# EAGLE design SpaStroWi_V1_R0 (EAGLE 7.7.0)
ABTEILUNG: Technische Informatik; BEARBEITER: Leon Hipf; DATUM: 20.3.2021; DOKUMENTART: Schaltplan; GEZ: HipL; ID: 5; REV: 0; SCHALTPLAN: SpaStroWi; STATUS: Prototyp; VER: 1.0

## Sheet 1 of 2
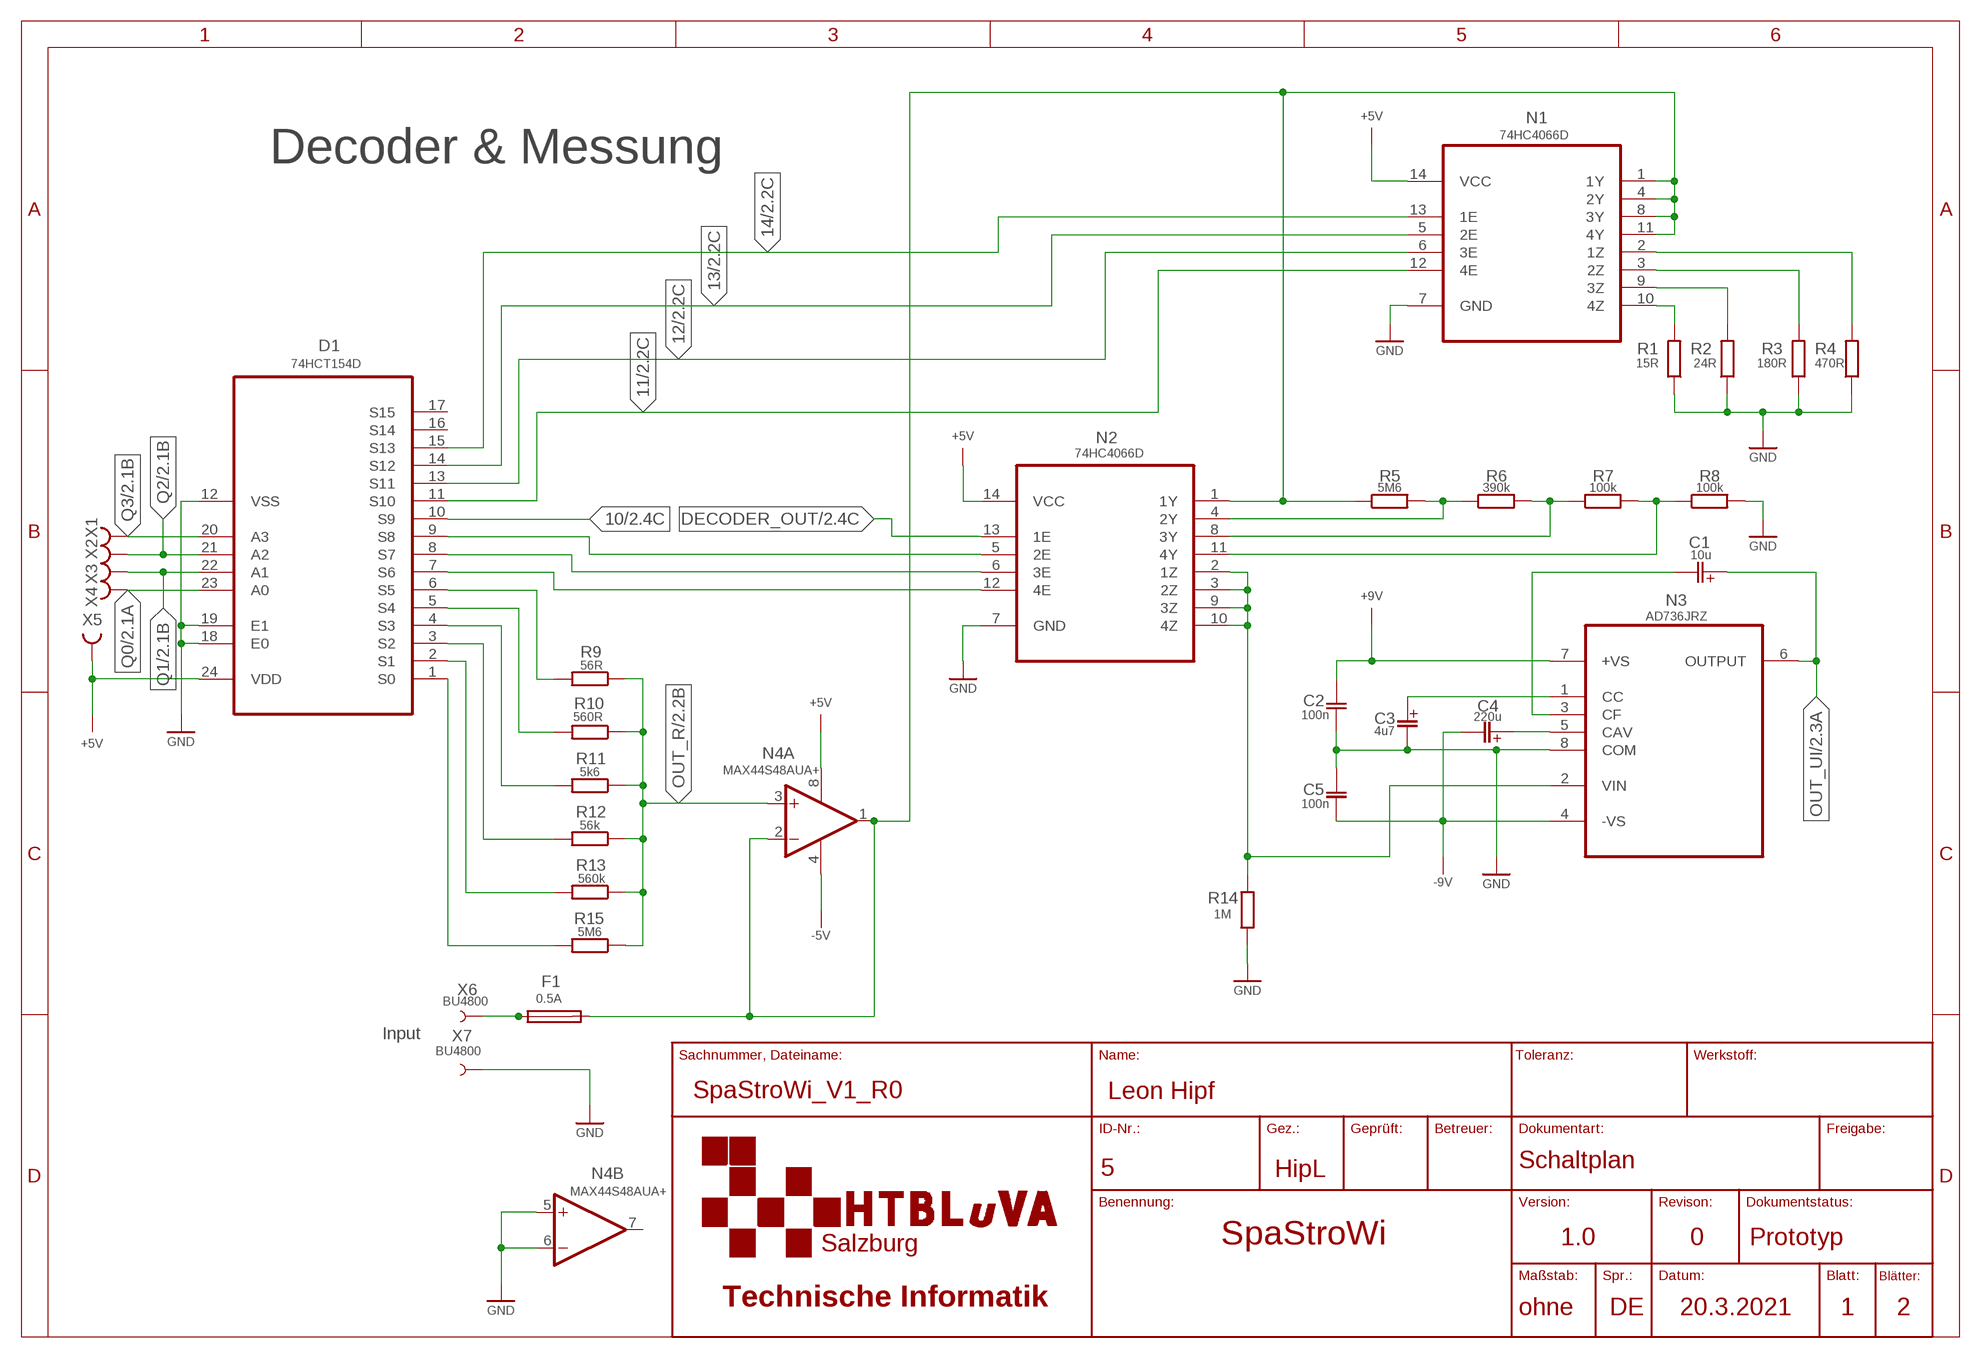
[diagram p0: schematic, sheet 1]

### Parts
C1  10u  CPOL-EU153CLV-0405  [153CLV-0405]
C2  100n  C-EUC0805  [C0805]
C3  4u7  CPOL-EU153CLV-0405  [153CLV-0405]
C4  220u  CPOL-EU153CLV-0405  [153CLV-0405]
C5  100n  C-EUC0805  [C0805]
D1  74HCT154D  [SOIC127P1030X265-24N]
F1  0.5A  [354-0101ZXGY]
N1  74HC4066D  74HC4066D,653  [SOIC127P600X175-14N]
N2  74HC4066D  74HC4066D,653  [SOIC127P600X175-14N]
N3  AD736JRZ  AD736JRZ_THT  [DIP794W45P254L959H508Q8]
N4  MAX44S48AUA+  [SOP65P490X110-8N]
R1  15R  R-EU_R2010  [R2010]
R2  24R  R-EU_R2512  [R2512]
R3  180R  R-EU_R0402  [R0402]
R4  470R  R-EU_R0805  [R0805]
R5  5M6  R-EU_R0805  [R0805]
R6  390k  R-EU_R0805  [R0805]
R7  100k  R-EU_R0805  [R0805]
R8  100k  R-EU_R0805  [R0805]
R9  56R  R-EU_R0805  [R0805]
R10  560R  R-EU_R0805  [R0805]
R11  5k6  R-EU_R0805  [R0805]
R12  56k  R-EU_R0805  [R0805]
R13  560k  R-EU_R0805  [R0805]
R14  1M  R-EU_R0805  [R0805]
R15  5M6  R-EU_R0805  [R0805]
X1  BUCHSE-V_0.8MM  [LSP08]
X2  BUCHSE-V_0.8MM  [LSP08]
X3  BUCHSE-V_0.8MM  [LSP08]
X4  BUCHSE-V_0.8MM  [LSP08]
X5  BUCHSE-V_0.8MM  [LSP08]
X6  BU4800  [BU4800]
X7  BU4800  [BU4800]

### Nets
10: D1.10(S9) ; also sheet 2
11: D1.11(S10) N1.12(4E) ; also sheet 2
12: D1.13(S11) N1.6(3E) ; also sheet 2
13: D1.14(S12) N1.5(2E) ; also sheet 2
14: D1.15(S13) N1.13(1E) ; also sheet 2
+5V: D1.24(VDD) N1.14(VCC) N2.14(VCC) N4.8(A:VCC+) X5.MP ; also sheet 2
+9V: C2.1 N3.7(+VS) ; also sheet 2
-5V: N4.4(A:VCC-) ; also sheet 2
-9V: C4.- C5.2 N3.4(-VS) ; also sheet 2
DECODER_OUT: N2.13(1E) ; also sheet 2
GND: C2.2 C3.- C5.1 D1.12(VSS) D1.18(E0) D1.19(E1) N1.7(GND) N2.7(GND) N3.8(COM) N4.5(B:NON-INVERTING_INPUT2) N4.6(B:INVERTING_INPUT2) R1.1 R2.1 R3.1 R4.1 R8.2 R14.1 X7.P$1(KL) ; also sheet 2
INPUT: F1.2 N1.1(1Y) N1.4(2Y) N1.8(3Y) N1.11(4Y) N2.1(1Y) N4.1(A:OUTPUT1) N4.2(A:INVERTING_INPUT1) R5.1
N$1: D1.1(S0) R15.2
N$2: D1.2(S1) R13.2
N$3: D1.3(S2) R12.2
N$4: D1.4(S3) R11.2
N$5: D1.5(S4) R10.2
N$7: D1.7(S6) N2.12(4E)
N$10: F1.1 X6.P$1(KL)
N$12: N1.10(4Z) R1.2
N$13: N1.9(3Z) R2.2
N$15: C3.+ N3.1(CC)
N$20: N2.8(3Y) R6.2 R7.1
N$21: N1.3(2Z) R3.2
N$22: N1.2(1Z) R4.2
N$23: N2.11(4Y) R7.2 R8.1
N$24: N2.4(2Y) R5.2 R6.1
N$28: N2.2(1Z) N2.3(2Z) N2.9(3Z) N2.10(4Z) N3.2(VIN) R14.2
N$31: C4.+ N3.5(CAV)
N$32: C1.- N3.3(CF)
N$33: D1.6(S5) R9.2
N$37: D1.8(S7) N2.6(3E)
N$39: D1.9(S8) N2.5(2E)
OUT_R: N4.3(A:NON-INVERTING_INPUT1) R9.1 R10.1 R11.1 R12.1 R13.1 R15.1 ; also sheet 2
OUT_UI: C1.+ N3.6(OUTPUT) ; also sheet 2
Q0: D1.23(A0) X4.MP ; also sheet 2
Q1: D1.22(A1) X3.MP ; also sheet 2
Q2: D1.21(A2) X2.MP ; also sheet 2
Q3: D1.20(A3) X1.MP ; also sheet 2
Unconnected: D1.16(S14) D1.17(S15) N4.7(B:OUTPUT2)

### Notes on the sheet
- Decoder & Messung
- Input

## Sheet 2 of 2
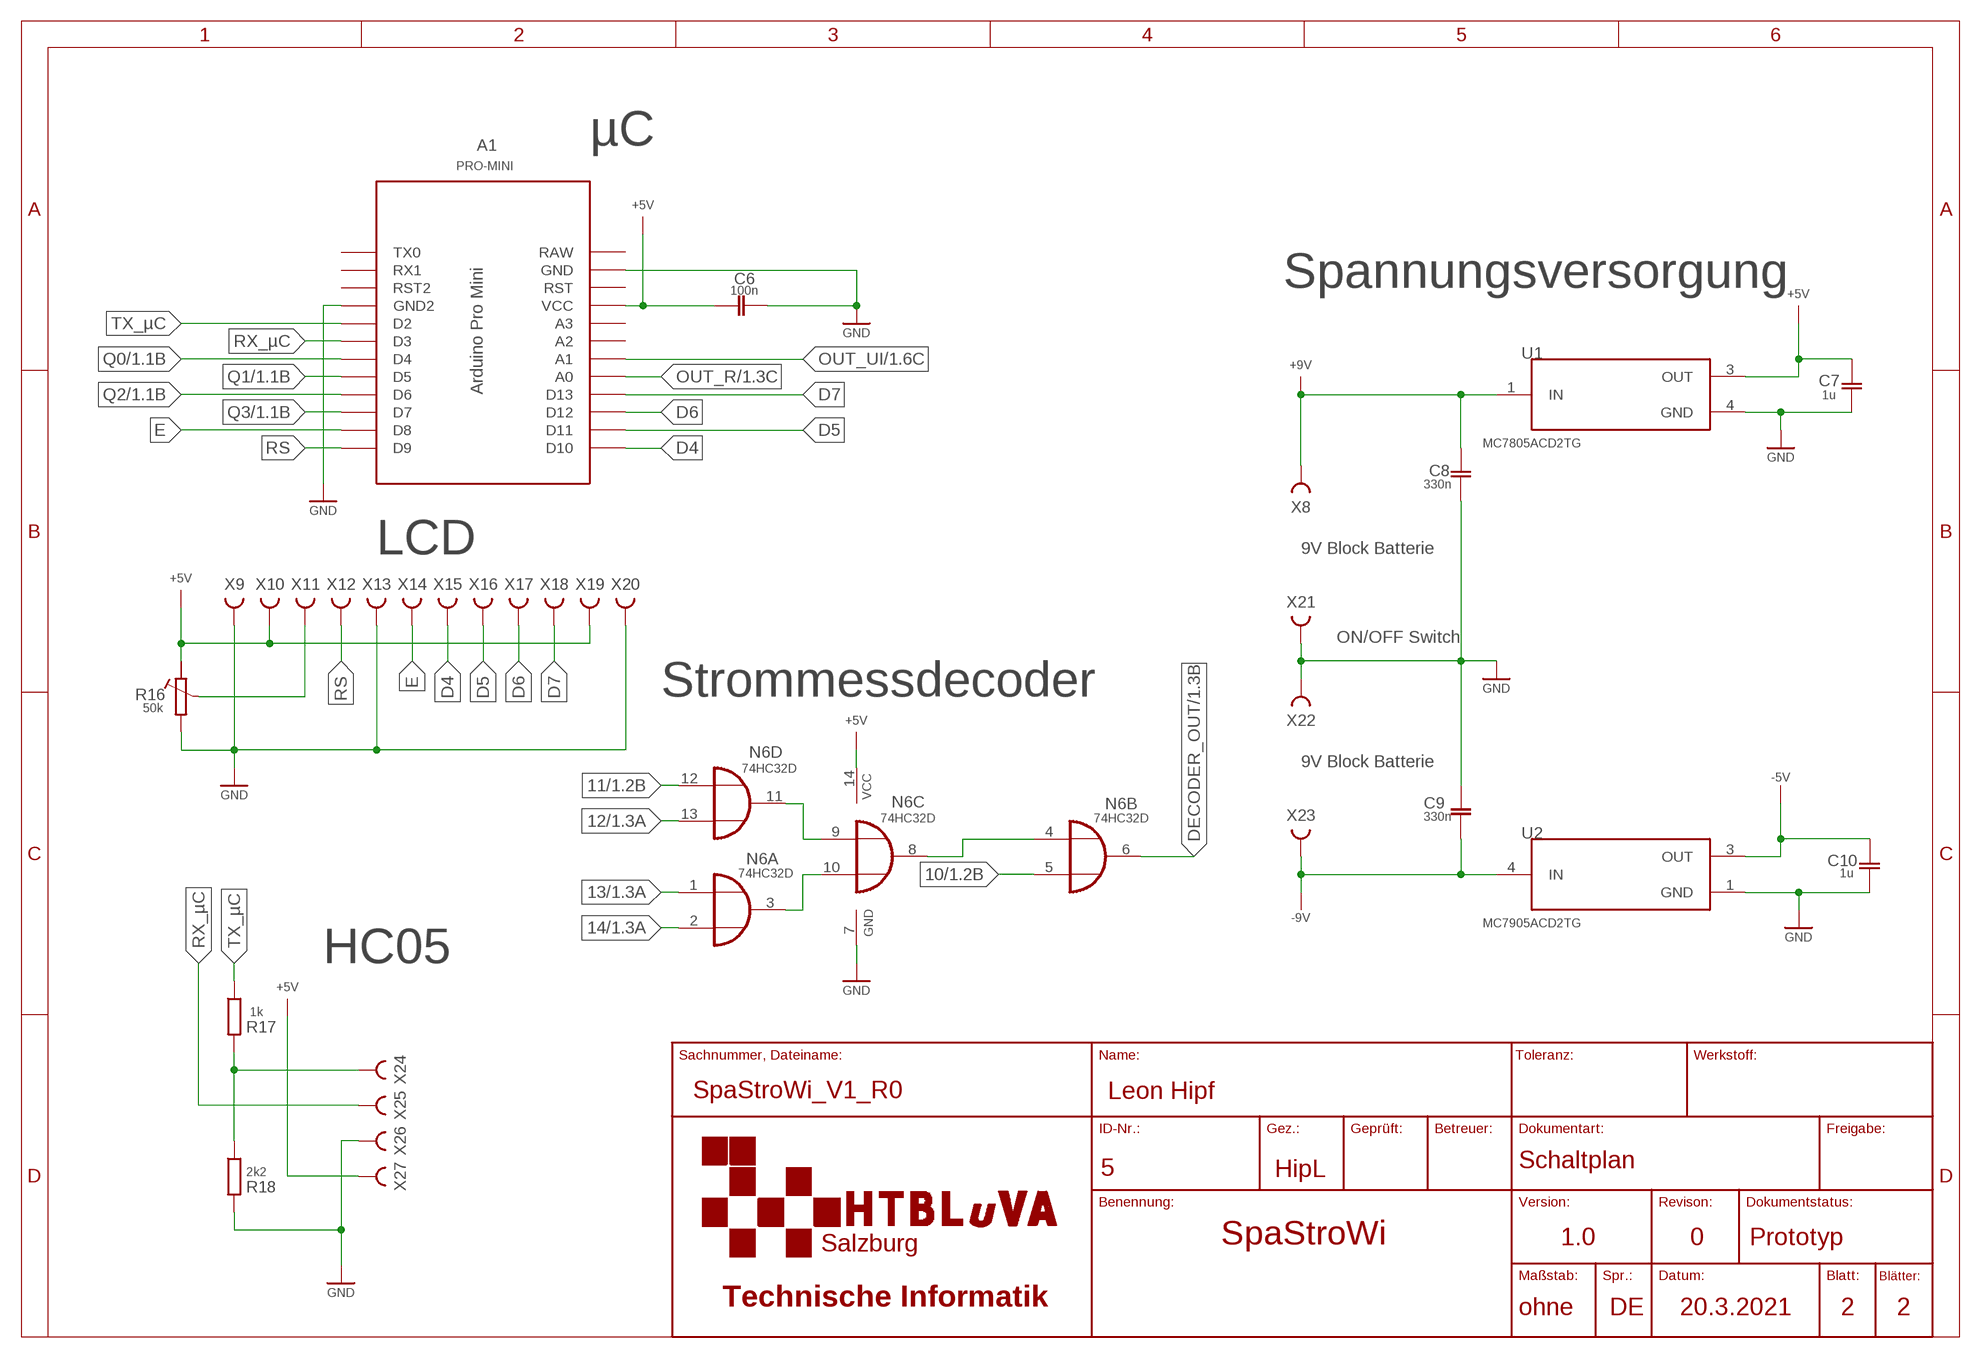
[diagram p1: schematic, sheet 2]

### Parts
A1  PRO-MINI  [PRO-MINI]
C6  100n  C-EUC0805  [C0805]
C7  1u  C-EUC0805  [C0805]
C8  330n  C-EUC0805  [C0805]
C9  330n  C-EUC0805  [C0805]
C10  1u  C-EUC0805  [C0805]
N6  74HC32D  [SO14]
R16  50k  R-TRIMMPTV09  [PTV09]
R17  1k  R-EU_R0805  [R0805]
R18  2k2  R-EU_R0805  [R0805]
U1  MC7805ACD2TG  [TO254P1420X457-3N]
U2  MC7905ACD2TG  [TO254P1420X457-3N]
X8  BUCHSE-V_0.8MM  [LSP08]
X9  BUCHSE-V_0.8MM  [LSP08]
X10  BUCHSE-V_0.8MM  [LSP08]
X11  BUCHSE-V_0.8MM  [LSP08]
X12  BUCHSE-V_0.8MM  [LSP08]
X13  BUCHSE-V_0.8MM  [LSP08]
X14  BUCHSE-V_0.8MM  [LSP08]
X15  BUCHSE-V_0.8MM  [LSP08]
X16  BUCHSE-V_0.8MM  [LSP08]
X17  BUCHSE-V_0.8MM  [LSP08]
X18  BUCHSE-V_0.8MM  [LSP08]
X19  BUCHSE-V_0.8MM  [LSP08]
X20  BUCHSE-V_0.8MM  [LSP08]
X21  BUCHSE-V_0.8MM  [LSP08]
X22  BUCHSE-V_0.8MM  [LSP08]
X23  BUCHSE-V_0.8MM  [LSP08]
X24  BUCHSE-V_0.8MM  [LSP08]
X25  BUCHSE-V_0.8MM  [LSP08]
X26  BUCHSE-V_0.8MM  [LSP08]
X27  BUCHSE-V_0.8MM  [LSP08]

### Nets
10: N6.5(B:I1) ; also sheet 1
11: N6.12(D:I0) ; also sheet 1
12: N6.13(D:I1) ; also sheet 1
13: N6.1(A:I0) ; also sheet 1
14: N6.2(A:I1) ; also sheet 1
+5V: A1.VCC C6.1 C7.1 N6.14(P:VCC) R16.1(E) U1.3(OUT) X10.MP X19.MP X27.MP ; also sheet 1
+9V: C8.2 U1.1(IN) X8.MP ; also sheet 1
-5V: C10.1 U2.3(OUT) ; also sheet 1
-9V: C9.1 U2.4(IN) X23.MP ; also sheet 1
D4: A1.D10 X15.MP
D5: A1.D11 X16.MP
D6: A1.D12 X17.MP
D7: A1.D13 X18.MP
DECODER_OUT: N6.6(B:O) ; also sheet 1
E: A1.D8 X14.MP
GND: A1.GND A1.GND1(GND2) C6.2 C7.2 C8.1 C9.2 C10.2 N6.7(P:GND) R16.3(A) R18.2 U1.4(GND) U2.1(GND) X9.MP X13.MP X20.MP X21.MP X22.MP X26.MP ; also sheet 1
N$6: N6.4(B:I0) N6.8(C:O)
N$8: R17.2 R18.1 X24.MP
N$9: N6.9(C:I0) N6.11(D:O)
N$11: N6.3(A:O) N6.10(C:I1)
N$14: R16.2(S) X11.MP
OUT_R: A1.A0 ; also sheet 1
OUT_UI: A1.A1 ; also sheet 1
Q0: A1.D4 ; also sheet 1
Q1: A1.D5 ; also sheet 1
Q2: A1.D6 ; also sheet 1
Q3: A1.D7 ; also sheet 1
RS: A1.D9 X12.MP
RX_µC: A1.D3 X25.MP
TX_µC: A1.D2 R17.1
Unconnected: A1.A2 A1.A3 A1.RST A1.RST1(RST2) A1.RX1 A1.TX0

### Notes on the sheet
- µC
- Spannungsversorgung
- LCD | 9V Block Batterie
- ON/OFF Switch
- Strommessdecoder
- 9V Block Batterie
- HC05

## Power pins joined to a net without a drawn wire
RAW: A1.RAW

## Library data of the parts
A1 = Module_uC:PRO-MINI: Arduion Pro Mini Clone V1.0 www.betemcu.cu
C1 C3 C4 = rcl_HipL:CPOL-EU: POLARIZED CAPACITOR, European symbol
C2 C5-C10 = rcl_HipL:C-EU: CAPACITOR, European symbol
D1 = ic-logik_HipL:74HCT154D
F1 = fuse_HipL:0.5A
N1 N2 = Transistor_HipL:74HC4066D,653: Quad bilateral switches Check prices <https://pricing.snapeda.com/parts/74HC4066D%2C653/Nexperia/view-part?ref=eda>; AVAILABILITY: Good; DESCRIPTION: 4 Circuit IC Switch 1:1 95Ohm 14-SO; MF: Nexperia; MP: 74HC4066D,653; PACKAGE: SO14-14 Nexperia USA Inc.; PRICE: None; PURCHASE-URL: https://pricing.snapeda.com/search/part/74HC4066D,653/?ref=eda
N3 = ic-other_HipL:AD736JRZ_THT: Low Cost, Low Power,True RMS-to-DC Converter Check prices <https://pricing.snapeda.com/parts/AD736JRZ/Analog%20Devices%20Inc./view-part?ref=eda>
N4 = ic-linear_HipL:MAX44S48AUA+
N6 = 74xx-eu:74*32: Quad 2-input OR gate
R1-R15 R17 R18 = rcl_HipL:R-EU_: RESISTOR, European symbol
R16 = rcl_HipL:R-TRIMM: Trimm resistor
U1 = ic-vreg_HipL:MC7805ACD2TG: 1.0 A Positive Voltage Regulators Check prices <https://pricing.snapeda.com/parts/MC7805ACD2TG/ON%20Semiconductor/view-part?ref=eda>; AVAILABILITY: Warning; DESCRIPTION: Linear Voltage Regulator IC Positive Fixed 1 Output 1A D2PAK; MF: ON Semiconductor; MP: MC7805ACD2TG; PACKAGE: D2PAK-3 ON Semiconductor; PRICE: None; PURCHASE-URL: https://pricing.snapeda.com/search/part/MC7805ACD2TG/?ref=eda
U2 = ic-vreg_HipL:MC7905ACD2TG: 1.0 A Negative Voltage Regulators Check prices <https://pricing.snapeda.com/parts/MC7805ACD2TG/ON%20Semiconductor/view-part?ref=eda>; AVAILABILITY: Warning; DESCRIPTION: Linear Voltage Regulator IC Positive Fixed 1 Output 1A D2PAK; MF: ON Semiconductor; MP: MC7805ACD2TG; PACKAGE: D2PAK-3 ON Semiconductor; PRICE: None; PURCHASE-URL: https://pricing.snapeda.com/search/part/MC7805ACD2TG/?ref=eda
X1-X5 X8-X27 = solpad_HTBL:BUCHSE-V_: SOLDER PAD HTL 16/17 drill 0.8 mm, 1.0 mm, 1.3 mm
X6 X7 = con_HipL:BU4800

## Board
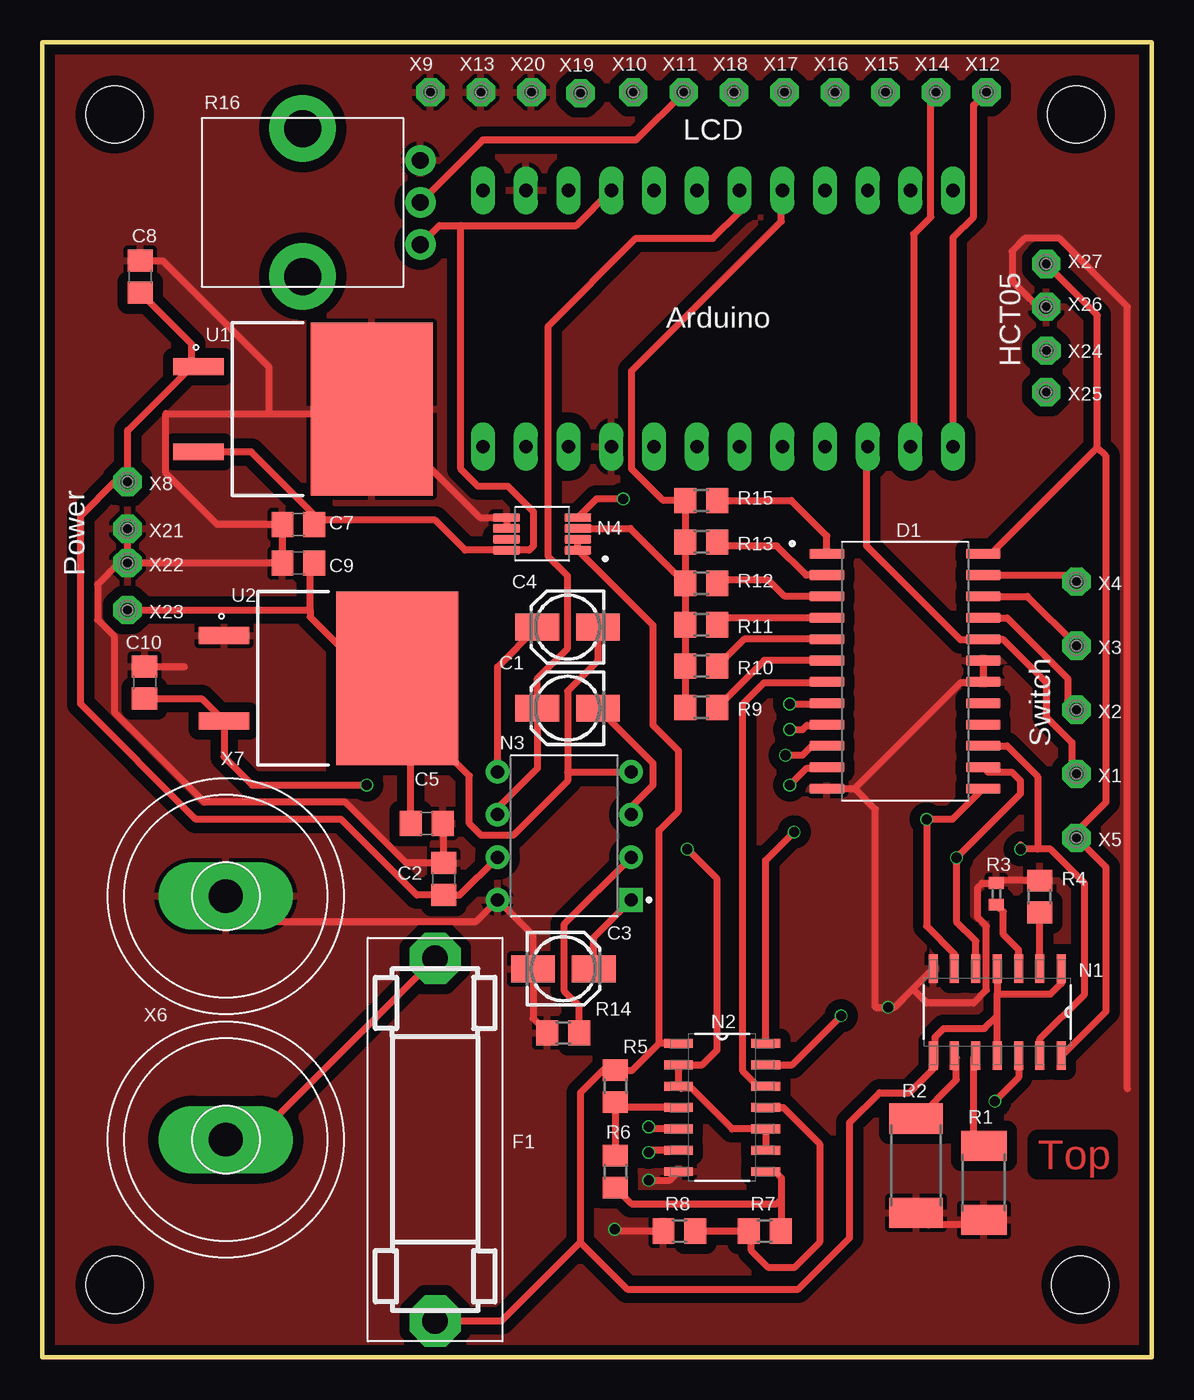
[diagram p2: board, top side]
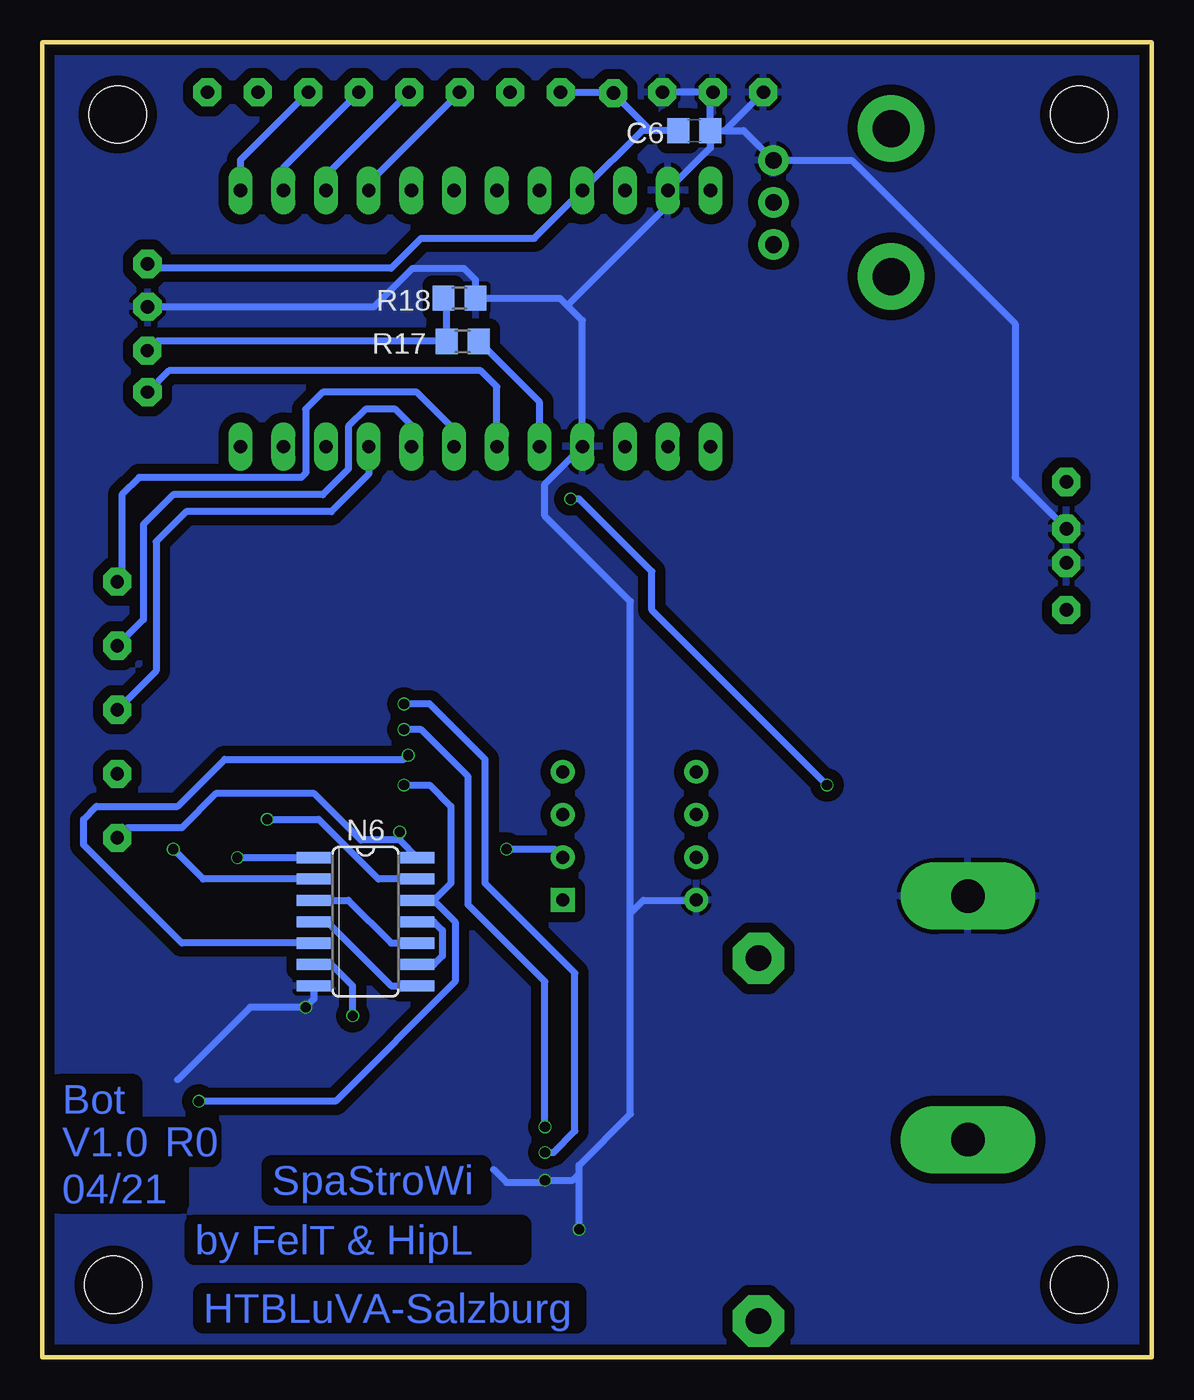
[diagram p3: board, bottom side, seen from below]

Size 65.96 x 78.22 mm. Coordinates in mm from the lower left corner, seen from the top.
Outline: 0,0 65.96,0 65.96,78.22 0,78.22 0,0
Copper layers (1*16): Top 0.035mm / dielectric 1.6mm / Bottom 0.035mm
Design rules "jlcpcb-2layers": minimum track width 5mil, minimum drill 0.3mm, track to track 5mil, track to pad 5mil, pad to pad 5mil, via to via 5mil, smd to smd 5mil, copper to edge 0.2mm, drill to drill 6mil, minimum pad ring 10mil, minimum via ring 3mil, stop-mask expansion 4mil, vias tented up to drill 0mil, thermal gap 10mil
Holes 3.4 mm at 4.32,73.91 61.47,73.91 61.72,4.32 4.32,4.32

### Footprints (pad centres in the part's own frame; a part is rotated, then mirrored left to right if it is on the bottom)
PRO-MINI = drill 0.8 long: A0 8.89,8.89; A1 8.89,11.43; A2 8.89,13.97; A3 8.89,16.51; D2 -6.35,16.51; D3 -6.35,13.97; D4 -6.35,11.43; D5 -6.35,8.89; D6 -6.35,6.35; D7 -6.35,3.81; D8 -6.35,1.27; D9 -6.35,-1.27; D10 8.89,-1.27; D11 8.89,1.27; D12 8.89,3.81; D13 8.89,6.35; GND 8.89,24.13; GND1 -6.35,19.05; RAW 8.89,26.67; RST 8.89,21.59; RST1 -6.35,21.59; RX1 -6.35,24.13; TX0 -6.35,26.67; VCC 8.89,19.05
153CLV-0405 = smd 2.6 x 1.6: + 1.8,0; - -1.8,0
C0805 = smd 1.3 x 1.5: 1 -0.95,0; 2 0.95,0
SOIC127P1030X265-24N = smd 2.06 x 0.6: 1 -4.64,6.985; 2 -4.64,5.715; 3 -4.64,4.445; 4 -4.64,3.175; 5 -4.64,1.905; 6 -4.64,0.635; 7 -4.64,-0.635; 8 -4.64,-1.905; 9 -4.64,-3.175; 10 -4.64,-4.445; 11 -4.64,-5.715; 12 -4.64,-6.985; 13 4.64,-6.985; 14 4.64,-5.715; 15 4.64,-4.445; 16 4.64,-3.175; 17 4.64,-1.905; 18 4.64,-0.635; 19 4.64,0.635; 20 4.64,1.905; 21 4.64,3.175; 22 4.64,4.445; 23 4.64,5.715; 24 4.64,6.985
354-0101ZXGY = drill 1.524 pad 3.048 octagon: 1 -10.78,0; 2 10.78,0
SOIC127P600X175-14N = smd 1.702 x 0.533: 1 -2.591,3.81; 2 -2.591,2.54; 3 -2.591,1.27; 4 -2.591,0; 5 -2.591,-1.27; 6 -2.591,-2.54; 7 -2.591,-3.81; 8 2.591,-3.81; 9 2.591,-2.54; 10 2.591,-1.27; 11 2.591,0; 12 2.591,1.27; 13 2.591,2.54; 14 2.591,3.81
DIP794W45P254L959H508Q8 = drill 0.78 pad 1.13 square: 1 -3.97,3.81 | drill 0.78 pad 1.13: 2 -3.97,1.27; 3 -3.97,-1.27; 4 -3.97,-3.81; 5 3.97,-3.81; 6 3.97,-1.27; 7 3.97,1.27; 8 3.97,3.81
SOP65P490X110-8N = smd 1.62 x 0.5: 1 -2.12,0.975; 2 -2.12,0.325; 3 -2.12,-0.325; 4 -2.12,-0.975; 5 2.12,-0.975; 6 2.12,-0.325; 7 2.12,0.325; 8 2.12,0.975
SO14 = smd 0.66 x 2.032: 1 -3.81,-3.073; 2 -2.54,-3.073; 3 -1.27,-3.073; 4 0,-3.073; 5 1.27,-3.073; 6 2.54,-3.073; 7 3.81,-3.073; 8 3.81,3.073; 9 2.54,3.073; 10 1.27,3.073; 11 0,3.073; 12 -1.27,3.073; 13 -2.54,3.073; 14 -3.81,3.073
R2010 = smd 1.8 x 2.7: 1 -2.2,0; 2 2.2,0
R2512 = smd 1.8 x 3.2: 1 -2.8,0; 2 2.8,0
R0402 = smd 0.7 x 0.9: 1 -0.65,0; 2 0.65,0
R0805 = smd 1.3 x 1.5: 1 -0.95,0; 2 0.95,0
PTV09 = drill 1: 1 -2.5,0; 2 0,0; 3 2.5,0 | drill 2.2: NC1 -4.4,7; NC2 4.4,7
TO254P1420X457-3N = smd 3 x 1: 1 -6.2,2.54; 3 -6.2,-2.54 | smd 7.25 x 10.3: 4 4.1,0
LSP08 = drill 0.8 pad 1.676 octagon: MP 0,0
BU4800 = drill 2 pad 4 long: P$1 0,0

### Placement (x,y rotation side)
A1  52.89,60.52 90 top
C1  31.24,38.61 180 top
C2  23.88,28.45 90 top
C3  30.99,23.11 0 top
C4  31.24,43.43 180 top
C5  22.86,31.75 180 top
C6  27.19,72.95 0 bottom
C7  15.24,49.53 180 top
C8  5.84,64.26 270 top
C9  15.24,47.24 180 top
C10  6.1,40.13 90 top
D1  51.3,40.81 0 top
F1  23.37,12.95 270 top
N1  56.78,20.53 270 top
N2  40.43,14.86 0 top
N3  31.04,31.01 180 top
N4  29.73,48.97 180 top
N6  46.74,25.91 270 bottom
R1  55.98,10.39 90 top
R2  51.95,11.4 90 top
R3  56.73,27.57 270 top
R4  59.3,27.4 270 top
R5  34.08,16.13 270 top
R6  34.08,11.05 270 top
R7  42.97,7.51 180 top
R8  37.89,7.51 180 top
R9  39.18,38.66 0 top
R10  39.18,41.12 0 top
R11  39.18,43.58 0 top
R12  39.18,46.04 0 top
R13  39.18,48.5 0 top
R14  30.99,19.3 0 top
R15  39.18,50.96 0 top
R16  22.49,68.68 90 top
R17  40.96,60.43 180 bottom
R18  41.15,62.99 0 bottom
U1  15.49,56.39 0 top
U2  17.02,40.39 0 top
X1  61.49,34.71 0 top
X2  61.49,38.52 0 top
X3  61.49,42.33 0 top
X4  61.49,46.14 0 top
X5  61.49,30.9 0 top
X6  10.92,12.95 0 top
X7  10.92,27.43 0 top
X8  5.08,52.07 0 top
X9  23.09,75.24 0 top
X10  35.14,75.24 0 top
X11  38.14,75.24 0 top
X12  56.14,75.24 0 top
X13  26.09,75.24 0 top
X14  53.14,75.24 0 top
X15  50.14,75.24 0 top
X16  47.14,75.24 0 top
X17  44.14,75.24 0 top
X18  41.14,75.24 0 top
X19  32,75.18 0 top
X20  29.09,75.24 0 top
X21  5.08,49.28 0 top
X22  5.08,47.24 0 top
X23  5.08,44.45 0 top
X24  59.71,59.87 0 top
X25  59.69,57.4 0 top
X26  59.69,62.48 0 top
X27  59.69,65.02 0 top

### Tracks (layer width: path | path; a pad name or v marks a point on that pad's centre or on a via)
10  (via drill 0.6)
  Top 0.406: v44.2,35.81 45.21,35.81 45.72,36.32 46.62,36.32 D1.10
  Bottom 0.406: N6.5 57.66,24.64 63.5,30.48 63.5,32 62.74,32.77 57.91,32.77 55.12,35.56 44.45,35.56 v44.2,35.81
11  (via drill 0.6)
  Top 0.406: 46.27,35.09 D1.11 46.62,35.05 45.47,35.05 v44.45,34.04 | N1.12 58.05,16.65 v56.64,15.24
  Bottom 0.406: 42.67,27.18 41.66,28.19 41.66,32.77 42.93,34.04 v44.45,34.04 | N6.12 42.67,27.18 | 42.67,27.18 41.4,25.91 41.4,22.35 48.51,15.24 v56.64,15.24
12  (via drill 0.6)
  Top 0.406: 55.9,33.78 D1.13 54.12,32 v52.58,32 52.58,25.65 54.24,23.99 N1.6
  Bottom 0.406: N6.13 45.97,28.45 49.53,32 v52.58,32
13  (via drill 0.6)
  Top 0.406: D1.14 56.23,34.8 57.66,34.8 58.17,34.29 58.17,33.53 v54.36,29.72 54.36,25.91 55.51,24.76 N1.5
  Bottom 0.406: N6.1 v54.36,29.72
14  (via drill 0.6)
  Top 0.406: 58.17,30.48 v58.17,30.23 59.18,30.23 | N1.13 59.32,18.93 61.98,21.59 61.98,28.19 59.94,30.23 59.18,30.23 | D1.15 57.36,36.37 59.18,34.54 59.18,30.23
  Bottom 0.406: N6.2 56.39,28.45 v58.17,30.23
+5V  (via drill 0.6)
  Top 0.406: 62.74,54.1 56.43,47.8 D1.24 | 62.74,54.1 62.74,61.98 X27.MP | 62.74,54.1 63.25,53.59 63.25,33.02 61.49,31.27 X5.MP 63.25,29.14 63.25,20.57 60.61,17.94 N1.14 | N2.14 43.02,29.56 v44.7,31.24 | 24.89,67.31 23.62,67.31 R16.1 | 24.89,67.31 31.75,67.31 A1.VCC | U1.3 12.45,53.85 16.19,50.1 C7.1 16.44,49.78 23.37,49.78 25.15,48 N4.8 28.96,48.01 29.21,48.26 29.21,50.29 27.69,51.82 25.91,51.82 24.89,52.83 24.89,67.31
  Bottom 0.406: 35.14,74.84 X10.MP 32.06,75.24 X19.MP 29.77,72.95 C6.1 30.3,72.95 A1.VCC 36.7,66.55 43.43,66.55 45.21,64.77 59.44,64.77 X27.MP | v44.7,31.24 44.7,30.76 | 44.7,30.76 N6.14 | 44.7,30.76 47.02,30.76 49.78,33.53 55.63,33.53 57.66,31.5 60.89,31.5 X5.MP
+9V
  Top 0.406: 8.89,58.93 5.08,55.12 X8.MP 4.32,52.07 2.29,50.04 2.29,38.86 9.14,32 17.78,32 22.29,27.5 C2.1 24.83,27.5 N3.7 | 8.89,58.93 U1.1 10.41,58.93 | 8.89,58.93 8.89,60.26 C8.2
-5V  (via drill 0.6)
  Top 0.406: v34.54,51.05 32.96,51.05 N4.4 | C10.1 9.48,39.18 U2.3 10.82,35.71 12.49,34.04 v19.3,34.04
  Bottom 0.406: v19.3,34.04 29.72,44.45 29.72,46.74 34.04,51.05 v34.54,51.05
-9V
  Top 0.406: X23.MP 15.94,44.45 | 15.94,44.45 15.94,46.99 C9.1 | 15.94,44.45 15.94,44.04 19.59,40.39 U2.4 21.12,39.37 | C4.- 33.04,41.42 31.24,39.62 31.24,34.8 | 31.24,34.8 31.24,34.29 28,31.05 26.1,31.05 25.4,31.75 25.4,34.58 21.91,38.07 | C5.2 21.91,38.07 | 21.12,39.37 21.12,38.86 21.91,38.07 | 21.91,38.07 21.91,38.58 21.12,39.37 | N3.4 34.99,34.8 31.24,34.8
D4
  Bottom 0.406: A1.D10 54.16,71.21 X15.MP
D5
  Bottom 0.406: A1.D11 51.62,70.75 X16.MP
D6
  Bottom 0.406: A1.D12 49.08,70.29 X17.MP
D7
  Bottom 0.406: A1.D13 46.54,69.83 X18.MP
DECODER_OUT  (via drill 0.6)
  Top 0.406: N2.13 44.58,17.4 v47.5,20.32
  Bottom 0.406: v47.5,20.32 47.5,22.1 48.77,23.37 N6.6
E
  Top 0.406: A1.D8 51.82,54.36 51.82,66.8 52.83,67.82 52.83,74.93 X14.MP
GND  (via drill 0.6)
  Top 0.406: N4.6 N4.5 26.03,49.95 19.85,56.13 | 13.46,56.13 7.37,56.13 7.37,52.58 10.41,49.53 C7.2 C9.2 X22.MP | 13.46,56.13 19.05,56.13 | 19.05,56.13 19.85,56.13 | X22.MP X21.MP | X22.MP 4.57,47.24 3.3,45.97 3.3,43.88 4.32,42.86 4.32,38.35 9.65,33.02 18.03,33.02 21.66,29.4 C2.2 23.88,31.68 C5.1 | 8.47,41.08 C10.2 5.78,41.08 | R14.1 29.19,20.15 C3.- 29.19,25.09 N3.8 25.78,25.91 12.45,25.91 X7.P$1 | D1.19 D1.18 55.9,40.13 54.61,40.13 48.3,33.83 | R8.2 34.14,7.51 v34.04,7.62 | R4.1 56.86,28.35 R3.1 56.7,28.19 55.88,28.19 55.63,27.94 55.63,26.16 56.13,25.65 56.13,21.84 55.37,21.08 52.58,21.08 51.75,21.91 | 55.37,7.87 55.63,8.13 55.88,8.13 55.94,8.19 R1.1 55.89,8.09 | 55.37,7.87 56.39,7.87 | 64.52,16 64.52,62.48 60.45,66.55 58.42,66.55 57.66,65.79 57.66,64.01 59.18,62.48 X26.MP | 55.37,7.87 52.68,7.87 R2.1 51.95,8.26 | 52.97,22.72 N1.7 51.75,21.91 | 48.3,33.83 49.53,32.6 49.53,20.83 v50.29,20.83 50.67,20.83 51.75,21.91 | D1.12 48.3,33.83 | U2.1 10.31,42.93 | 19.85,56.13 U1.4 | 19.85,59.08 19.59,59.33 | 19.59,59.33 17.97,60.96 | U1.4 19.3,56.39 19.05,56.13 | U1.4 19.59,59.33 | v36.07,10.54 37.32,10.54 N2.7 | C8.1 7.18,65.21 13.46,58.93 13.46,56.13
  Bottom 0.406: C6.2 26.24,75.09 X13.MP X20.MP | X26.MP 46.23,62.48 43.94,64.77 40.89,64.77 40.2,64.07 R18.2 35.18,62.99 34.73,62.55 | 34.73,62.55 33.84,61.66 A1.GND1 36.07,51.94 36.07,50.04 30.99,44.96 30.99,26.42 | 49.78,22.1 N6.7 49.81,21.31 v50.29,20.83 53.59,20.83 57.91,16.51 | v34.04,7.62 34.04,10.92 | 34.04,10.92 34.04,11.43 30.99,14.48 30.99,26.42 | 30.99,26.42 30.23,27.18 27.1,27.18 N3.8 | 34.04,10.92 34.42,10.54 v36.07,10.54 36.2,10.41 38.35,10.41 39.12,11.18 | C6.2 25.37,72.95 X9.MP | C6.2 24.26,72.95 R16.3 17.84,71.18 8.13,61.47 8.13,52.32 X21.MP | C6.2 26.24,71.93 A1.GND 28.76,68.52 34.73,62.55
  pour Top (isolate 0.61): 0,78.23 0,0 66.04,0 66.04,78.23
  pour Bottom (isolate 0.61): 0,78.23 0,0 66.04,0 66.04,78.23
INPUT
  Top 0.406: N2.1 36.68,18.67 | N1.4 56.78,21.59 | N1.1 60.59,22.23 59.94,21.59 56.78,21.59 | N4.2 N4.1 36.32,43.53 36.32,37.59 37.85,36.07 37.85,32.51 36.68,31.35 36.68,18.67 | 53.09,17.82 53.09,17.27 51.56,15.75 49.78,15.75 48.01,13.97 48.01,7.11 44.96,4.06 34.8,4.06 32,6.86 | 53.09,17.82 N1.8 | 32,6.86 32,15.75 33.34,17.08 R5.1 35.09,17.08 36.68,18.67 | N1.11 56.78,20.32 | 56.78,20.32 56.78,21.59 | 53.09,17.82 53.09,19.05 53.59,19.56 56.02,19.56 56.78,20.32 | F1.2 27.32,2.17 32,6.86
N$1
  Top 0.406: D1.1 46.66,48.85 44.55,50.96 R15.2
N$2
  Top 0.406: D1.2 45.42,46.52 43.69,48.26 40.36,48.26 R13.2
N$3
  Top 0.406: D1.3 44.15,45.26 43.18,46.23 40.32,46.23 R12.2
N$4
  Top 0.406: D1.4 40.54,43.98 R11.2
N$5
  Top 0.406: D1.5 41.73,42.72 R10.2
N$6
  Bottom 0.406: N6.4 49.02,25.91 45.21,22.1 N6.8
N$7
  Top 0.406: N2.12 42.54,16.13 41.66,17.02 41.66,38.86 42.93,40.13 46.62,40.13 D1.7
N$8
  Bottom 0.406: R18.1 41.91,62.81 R17.2 59.15,60.43 X24.MP
N$9
  Bottom 0.406: N6.11 42.67,25.91 42.16,25.4 42.16,23.88 42.67,23.37 N6.9
N$10
  Top 0.406: X6.P$1 12.59,12.95 F1.1
N$11
  Bottom 0.406: N6.3 47.75,27.18 45.21,24.64 N6.10
N$12
  Top 0.406: N1.10 55.37,17.8 55.37,13.2 R1.2
N$13
  Top 0.406: R2.2 52.05,14.2 54.36,16.51 54.36,17.82 N1.9
N$14
  Top 0.406: X11.MP 38.14,75.22 35.31,72.39 26.2,72.39 R16.2
N$15
  Top 0.406: C3.+ 32.79,24.98 N3.1
N$20
  Top 0.406: N2.8 43.56,11.05 43.94,10.67 43.94,9.4 | 43.94,9.4 43.94,7.54 R7.1 | 43.94,9.4 43.69,9.14 35.04,9.14 R6.2
N$21
  Top 0.406: N1.3 58.05,24.25 57.15,25.15 57.15,26.5 R3.2
N$22
  Top 0.406: N1.2 59.32,26.44 R4.2
N$23
  Top 0.406: R8.1 R7.2 42.16,7.37 42.16,6.35 43.18,5.33 44.7,5.33 46.23,6.86 46.23,12.7 44.06,14.86 N2.11
N$24
  Top 0.406: N2.4 34.4,14.86 R5.2 R6.1
N$28  (via drill 0.6)
  Top 0.406: N2.9 N2.10 41.02,13.59 38.61,16 37.97,16 N2.3 N2.2 39.25,17.4 40.13,18.29 40.13,28.45 v38.35,30.23 | R14.2 31.94,20.89 31.05,21.78 31.05,25.78 N3.2
  Bottom 0.406: v38.35,30.23 35.5,30.23 N3.2
N$31
  Top 0.406: N3.5 27.07,41.07 C4.+
N$32
  Top 0.406: N3.3 35.01,32.73 36.32,34.04 36.32,35.33 C1.-
N$33
  Top 0.406: D1.6 42.92,41.45 R9.2
N$37  (via drill 0.6)
  Top 0.406: N2.6 36.2,12.32 v36.07,12.19 | v44.45,38.86 46.62,38.86 D1.8
  Bottom 0.406: v36.07,12.19 35.56,12.19 34.29,13.46 34.29,22.86 39.62,28.19 39.62,35.56 42.93,38.86 v44.45,38.86
N$39  (via drill 0.6)
  Top 0.406: v44.45,37.34 45.21,37.34 45.47,37.59 46.62,37.59 D1.9 | N2.5 36.19,13.59 v36.07,13.72
  Bottom 0.406: v44.45,37.34 43.43,37.34 40.64,34.54 40.64,26.92 36.07,22.35 v36.07,13.72
OUT_R
  Top 0.406: R12.1 R13.1 R15.1 36.93,50.96 35.05,52.83 35.05,58.67 43.94,67.56 43.94,69.34 A1.A0 | R9.1 R10.1 R11.1 R12.1 | N4.3 34.97,49.3 R12.1
OUT_UI
  Top 0.406: N3.6 27.07,32.66 29.46,35.05 29.46,38.59 C1.+ 29.44,40.36 31.24,42.16 31.24,46.48 30.1,47.62 30.1,61.34 35.31,66.55 39.88,66.55 41.46,68.13 A1.A1
Q0
  Top 0.406: D1.23 61.1,46.52 X4.MP
  Bottom 0.406: A1.D4 41.46,55.18 43.69,57.4 49.28,57.4 50.29,56.39 50.29,52.58 50.55,52.32 60.2,52.32 61.21,51.31 61.21,46.42 X4.MP 61.4,46.23
Q1
  Top 0.406: D1.22 58.56,45.26 X3.MP
  Bottom 0.406: A1.D5 44,55.43 44.96,56.39 46.74,56.39 47.75,55.37 47.75,52.83 49.28,51.31 58.17,51.31 59.94,49.53 59.94,43.88 X3.MP
Q2
  Top 0.406: D1.21 57.36,43.98 60.96,40.39 60.96,39.05 X2.MP
  Bottom 0.406: A1.D6 46.54,52.52 48.77,50.29 57.4,50.29 59.18,48.51 59.18,40.83 X2.MP
Q3
  Top 0.406: X1.MP 61.21,34.99 61.21,36.58 59.69,38.1 59.69,40.13 57.11,42.72 D1.20 55.9,42.67 54.61,42.67 49.02,48.26 49.02,54.1 A1.D7
RS
  Top 0.406: A1.D9 54.16,66.61 55.37,67.82 55.37,74.47 X12.MP
RX_µC
  Bottom 0.406: A1.D3 38.92,57.72 39.88,58.67 58.42,58.67 X25.MP
TX_µC
  Bottom 0.406: A1.D2 36.38,56.8 R17.1

### Text on the board
Top: Top
Bottom: Bot | R0 | V1.0 | SpaStroWi | 04/21 | by FelT & HipL | HTBLuVA-Salzburg
tPlace: LCD | X27 | X26 | Arduino | HCT05 | X24 | X25 | Power | Switch